# Altium schematic sheet MCU.SchDoc
size A4; SheetNumber: 10; SheetTotal: 10
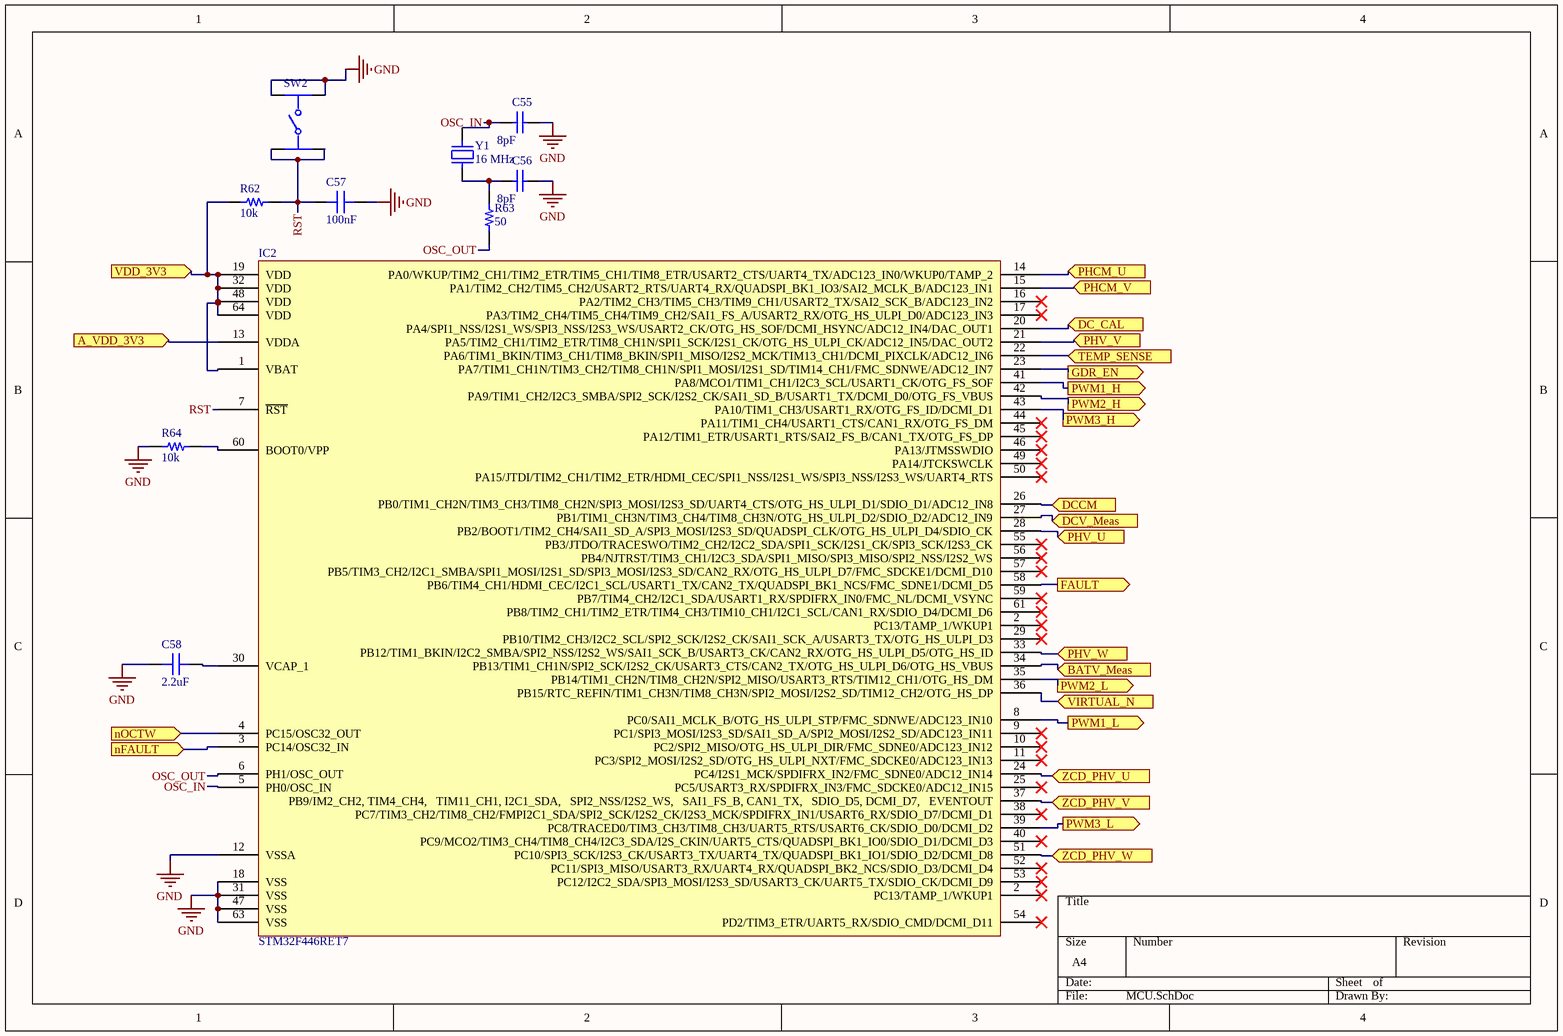
[diagram p0: MCU.SchDoc]

## Parts
C55  value 8pF  [CAPC1005X56X25LL10T15]  (hidden comment: 0402YA240JAT2A)
C56  value 8pF  [CAPC1005X56X25LL10T15]  (hidden comment: 0402YA240JAT2A)
C57  100nF  [CAP 0603_1608]
C58  2.2uF  [CAP 0603_1608]
IC2  STM32F446RET7  [ST LQFP-64 10X10MM]
R62  10k  [RES 0402_1005]
R63  50  [RES 0402_1005]
R64  10k  [RES 0402_1005]
SW2  3-1825910-1  [FP-3-1825910-1-MFG]  (value not drawn)
Y1  16 MHz  [NDK NX5032GA]

## Ports
A_VDD_3V3 (in, see DC-DC_Buck_Converter+12Vto+3.3V[4B]), BATV_Meas (in, see ADC_Input_protection[3C], DC_Current_Voltage_Measurement[2B]), DC_CAL (in, see MotorDrivers[1A]), DCCM (in, see ADC_Input_protection[3B], DC_Current_Voltage_Measurement[3A]), DCV_Meas (in, see ADC_Input_protection[2C], DC_Current_Voltage_Measurement[2B]), FAULT (out, see Power[2D]), GDR_EN (out, see MotorDrivers[1B], Power[2D]), nFAULT (in, see MotorDrivers[1A]), nOCTW (in, see MotorDrivers[2A]), PHCM_U (in, see ADC_Input_protection[2B], MotorDrivers[1C]), PHCM_V (in, see ADC_Input_protection[3B], MotorDrivers[1C]), PHV_U (in, see ADC_Input_protection[2B], PhaseVoltage[1A], ZeroCrossing[2B]), PHV_V (in, see ADC_Input_protection[3B], PhaseVoltage[1A], ZeroCrossing[2B]), PHV_W (in, see ADC_Input_protection[3B], PhaseVoltage[2A], ZeroCrossing[2C]), PWM1_H (out, see MotorDrivers[1B]), PWM1_L (out, see MotorDrivers[1B]), PWM2_H (out, see MotorDrivers[1B]), PWM2_L (out, see MotorDrivers[1B]), PWM3_H (out, see MotorDrivers[1B]), PWM3_L (out, see MotorDrivers[1B]), TEMP_SENSE (in, see DC_Current_Voltage_Measurement[3B]), VDD_3V3 (in, see ADC_Input_protection[3C], DC-DC_Buck_Converter+12Vto+3.3V[3C], DC_Current_Voltage_Measurement[3B], MotorDrivers[1A], MotorDrivers[1B], Power[2C], ZeroCrossing[1A]), VIRTUAL_N (in, see ADC_Input_protection[4B], PhaseVoltage[1A], ZeroCrossing[1B]), ZCD_PHV_U (in, see ZeroCrossing[3B]), ZCD_PHV_V (in, see ZeroCrossing[3B]), ZCD_PHV_W (in, see ZeroCrossing[3C])

## Nets
GND: C55.2 C56.2 C57.1 C58.2 IC2.12(VSSA) IC2.18(VSS) IC2.31(VSS) IC2.47(VSS) IC2.63(VSS) R64.1 SW2.3 SW2.4
A_VDD_3V3: IC2.13(VDDA) ; port A_VDD_3V3
BATV_Meas: IC2.34(PB13/TIM1_CH1N/SPI2_SCK/I2S2_CK/USART3_CTS/CAN2_TX/OTG_HS_ULPI_D6/OTG_HS_VBUS) ; port BATV_Meas
DC_CAL: IC2.20(PA4/SPI1_NSS/I2S1_WS/SPI3_NSS/I2S3_WS/USART2_CK/OTG_HS_SOF/DCMI_HSYNC/ADC12_IN4/DAC_OUT1) ; port DC_CAL
DCCM: IC2.26(PB0/TIM1_CH2N/TIM3_CH3/TIM8_CH2N/SPI3_MOSI/I2S3_SD/UART4_CTS/OTG_HS_ULPI_D1/SDIO_D1/ADC12_IN8) ; port DCCM
DCV_Meas: IC2.27(PB1/TIM1_CH3N/TIM3_CH4/TIM8_CH3N/OTG_HS_ULPI_D2/SDIO_D2/ADC12_IN9) ; port DCV_Meas
FAULT: IC2.58(PB6/TIM4_CH1/HDMI_CEC/I2C1_SCL/USART1_TX/CAN2_TX/QUADSPI_BK1_NCS/FMC_SDNE1/DCMI_D5) ; port FAULT
GDR_EN: IC2.23(PA7/TIM1_CH1N/TIM3_CH2/TIM8_CH1N/SPI1_MOSI/I2S1_SD/TIM14_CH1/FMC_SDNWE/ADC12_IN7) ; port GDR_EN
nFAULT: IC2.3(PC14/OSC32_IN) ; port nFAULT
nOCTW: IC2.4(PC15/OSC32_OUT) ; port nOCTW
OSC_IN: C55.1 IC2.5(PH0/OSC_IN) Y1.2
OSC_OUT: IC2.6(PH1/OSC_OUT) R63.1
PHCM_U: IC2.14(PA0/WKUP/TIM2_CH1/TIM2_ETR/TIM5_CH1/TIM8_ETR/USART2_CTS/UART4_TX/ADC123_IN0/WKUP0/TAMP_2) ; port PHCM_U
PHCM_V: IC2.15(PA1/TIM2_CH2/TIM5_CH2/USART2_RTS/UART4_RX/QUADSPI_BK1_IO3/SAI2_MCLK_B/ADC123_IN1) ; port PHCM_V
PHV_U: IC2.28(PB2/BOOT1/TIM2_CH4/SAI1_SD_A/SPI3_MOSI/I2S3_SD/QUADSPI_CLK/OTG_HS_ULPI_D4/SDIO_CK) ; port PHV_U
PHV_V: IC2.21(PA5/TIM2_CH1/TIM2_ETR/TIM8_CH1N/SPI1_SCK/I2S1_CK/OTG_HS_ULPI_CK/ADC12_IN5/DAC_OUT2) ; port PHV_V
PHV_W: IC2.33(PB12/TIM1_BKIN/I2C2_SMBA/SPI2_NSS/I2S2_WS/SAI1_SCK_B/USART3_CK/CAN2_RX/OTG_HS_ULPI_D5/OTG_HS_ID) ; port PHV_W
PWM1_H: IC2.41(PA8/MCO1/TIM1_CH1/I2C3_SCL/USART1_CK/OTG_FS_SOF) ; port PWM1_H
PWM1_L: IC2.8(PC0/SAI1_MCLK_B/OTG_HS_ULPI_STP/FMC_SDNWE/ADC123_IN10) ; port PWM1_L
PWM2_H: IC2.42(PA9/TIM1_CH2/I2C3_SMBA/SPI2_SCK/I2S2_CK/SAI1_SD_B/USART1_TX/DCMI_D0/OTG_FS_VBUS) ; port PWM2_H
PWM2_L: IC2.35(PB14/TIM1_CH2N/TIM8_CH2N/SPI2_MISO/USART3_RTS/TIM12_CH1/OTG_HS_DM) ; port PWM2_L
PWM3_H: IC2.43(PA10/TIM1_CH3/USART1_RX/OTG_FS_ID/DCMI_D1) ; port PWM3_H
PWM3_L: IC2.39(PC8/TRACED0/TIM3_CH3/TIM8_CH3/UART5_RTS/USART6_CK/SDIO_D0/DCMI_D2) ; port PWM3_L
RST: C57.2 IC2.7(~{RST}) R62.1 SW2.1 SW2.2
TEMP_SENSE: IC2.22(PA6/TIM1_BKIN/TIM3_CH1/TIM8_BKIN/SPI1_MISO/I2S2_MCK/TIM13_CH1/DCMI_PIXCLK/ADC12_IN6) ; port TEMP_SENSE
VDD_3V3: IC2.1(VBAT) IC2.19(VDD) IC2.32(VDD) IC2.48(VDD) IC2.64(VDD) R62.2 ; port VDD_3V3
VIRTUAL_N: IC2.36(PB15/RTC_REFIN/TIM1_CH3N/TIM8_CH3N/SPI2_MOSI/I2S2_SD/TIM12_CH2/OTG_HS_DP) ; port VIRTUAL_N
ZCD_PHV_U: IC2.24(PC4/I2S1_MCK/SPDIFRX_IN2/FMC_SDNE0/ADC12_IN14) ; port ZCD_PHV_U
ZCD_PHV_V: IC2.37(PB9/IM2_CH2,_TIM4_CH4,___TIM11_CH1,_I2C1_SDA,___SPI2_NSS/I2S2_WS,___SAI1_FS_B,_CAN1_TX,___SDIO_D5,_DCMI_D7,___EVENTOUT) ; port ZCD_PHV_V
ZCD_PHV_W: IC2.51(PC10/SPI3_SCK/I2S3_CK/USART3_TX/UART4_TX/QUADSPI_BK1_IO1/SDIO_D2/DCMI_D8) ; port ZCD_PHV_W
NetC56_1: C56.1 R63.2 Y1.1
NetC58_1: C58.1 IC2.30(VCAP_1)
NetIC2_60: IC2.60(BOOT0/VPP) R64.2

Not connected (* = marked no-connect by the designer): IC2 2(PC13/TAMP_1/WKUP1)* 9(PC1/SPI3_MOSI/I2S3_SD/SAI1_SD_A/SPI2_MOSI/I2S2_SD/ADC123_IN11)* 10(PC2/SPI2_MISO/OTG_HS_ULPI_DIR/FMC_SDNE0/ADC123_IN12)* 11(PC3/SPI2_MOSI/I2S2_SD/OTG_HS_ULPI_NXT/FMC_SDCKE0/ADC123_IN13)* 16(PA2/TIM2_CH3/TIM5_CH3/TIM9_CH1/USART2_TX/SAI2_SCK_B/ADC123_IN2)* 17(PA3/TIM2_CH4/TIM5_CH4/TIM9_CH2/SAI1_FS_A/USART2_RX/OTG_HS_ULPI_D0/ADC123_IN3)* 25(PC5/USART3_RX/SPDIFRX_IN3/FMC_SDCKE0/ADC12_IN15)* 29(PB10/TIM2_CH3/I2C2_SCL/SPI2_SCK/I2S2_CK/SAI1_SCK_A/USART3_TX/OTG_HS_ULPI_D3)* 38(PC7/TIM3_CH2/TIM8_CH2/FMPI2C1_SDA/SPI2_SCK/I2S2_CK/I2S3_MCK/SPDIFRX_IN1/USART6_RX/SDIO_D7/DCMI_D1)* 40(PC9/MCO2/TIM3_CH4/TIM8_CH4/I2C3_SDA/I2S_CKIN/UART5_CTS/QUADSPI_BK1_IO0/SDIO_D1/DCMI_D3)* 44(PA11/TIM1_CH4/USART1_CTS/CAN1_RX/OTG_FS_DM)* 45(PA12/TIM1_ETR/USART1_RTS/SAI2_FS_B/CAN1_TX/OTG_FS_DP)* 46(PA13/JTMSSWDIO)* 49(PA14/JTCKSWCLK)* 50(PA15/JTDI/TIM2_CH1/TIM2_ETR/HDMI_CEC/SPI1_NSS/I2S1_WS/SPI3_NSS/I2S3_WS/UART4_RTS)* 52(PC11/SPI3_MISO/USART3_RX/UART4_RX/QUADSPI_BK2_NCS/SDIO_D3/DCMI_D4)* 53(PC12/I2C2_SDA/SPI3_MOSI/I2S3_SD/USART3_CK/UART5_TX/SDIO_CK/DCMI_D9)* 54(PD2/TIM3_ETR/UART5_RX/SDIO_CMD/DCMI_D11)* 55(PB3/JTDO/TRACESWO/TIM2_CH2/I2C2_SDA/SPI1_SCK/I2S1_CK/SPI3_SCK/I2S3_CK)* 56(PB4/NJTRST/TIM3_CH1/I2C3_SDA/SPI1_MISO/SPI3_MISO/SPI2_NSS/I2S2_WS)* 57(PB5/TIM3_CH2/I2C1_SMBA/SPI1_MOSI/I2S1_SD/SPI3_MOSI/I2S3_SD/CAN2_RX/OTG_HS_ULPI_D7/FMC_SDCKE1/DCMI_D10)* 59(PB7/TIM4_CH2/I2C1_SDA/USART1_RX/SPDIFRX_IN0/FMC_NL/DCMI_VSYNC)* 61(PB8/TIM2_CH1/TIM2_ETR/TIM4_CH3/TIM10_CH1/I2C1_SCL/CAN1_RX/SDIO_D4/DCMI_D6)*

## Library data of the parts
C55 C56 = CMP-2008-02771-1: Manufacturer: AVX Interconnect / Elco; Part Number: 0402YA240JAT2A
C57 C58 = 0603ZC102KAT2A: CAP CER 1000PF 10V X7R 0603; manufacturer: AVX Corporation; Tolerance: ±10%; Part Number: 0603ZC102KAT2A; Applications: General Purpose; componentlink1description: Datasheet; componentlink1url: http://datasheets.avx.com/X7RDielectric.pdf; componentlink2description: DigiKey Link; componentlink2url: http://digikey.com/product-detail/en/avx-corporation/0603ZC102KAT2A/478-0603ZC102KAT2ACT-ND/11570315; Device Package: 0603 (1608 Metric); lastupdated: 2.09.2020 01:02:55; Lifecycle Status: Active; Minimum Order: 1; Mounting Type: Surface Mount, MLCC; Operating Temperature: -55°C ~ 125°C; Package / Case: 0603 (1608 Metric); packaging: TapeAndReel; partid: 27370; Part Status: Active; price: 0.01; series: -; Supplier 1: DigiKey; Supplier Part Number 1: 478-0603ZC102KAT2ACT-ND; Temperature Coefficient: X7R; Voltage - Rated: 10V
  C57: Value: 100nF; Capacitance: 100nF
  C58: Value: 2.2uF; Capacitance: 2.2uF
IC2 = STM32F446RET7: IC MCU 32BIT 512KB FLASH 64LQFP; Manufacturer: STMicroelectronics; Connectivity: CANbus, EBI/EMI, I²C, IrDA, LINbus, SAI, SD, SPDIF-Rx, SPI, UART/USART, USB, USB OTG; Core Processor: ARM® Cortex®-M4; Core Size: 32-Bit Single-Core; Data Converters: A/D 16x12b; D/A 2x12b; Number of I/O: 50; Oscillator Type: Internal; Peripherals: Brown-out Detect/Reset, DMA, I²S, LVD, POR, PWM, WDT; Program Memory Size: 512KB (512K x 8); RAM Size: 128K x 8; Speed: 180MHz; Voltage - Supply (Vcc/Vdd): 1.7V ~ 3.6V; Part Number: STM32F446RET7; ComponentLink1Description: Datasheet; ComponentLink1URL: https://www.st.com/content/ccc/resource/technical/document/datasheet/65/cb/75/50/53/d6/48/24/DM00141306.pdf/files/DM00141306.pdf/jcr:content/translations/en.DM00141306.pdf; ComponentLink2Description: DigiKey Link; ComponentLink2URL: https://www.digikey.com/en/products/detail/stmicroelectronics/STM32F446RET7/6207480; LastUpdated: 5.10.2023 20:25:32; Lifecycle Status: Active; Minimum Order: 1; Mounting Type: Surface Mount; Operating Temperature: -40°C ~ 105°C (TA); Packaging: Tray; PartId: 220; Part Status: Active; Price: 6.42; Program Memory Type: FLASH; Series: STM32F4; Supplier 1: DigiKey; Supplier Part Number 1: 497-16775-ND; Supplier Device Package: 64-LQFP (10x10)
R62 R64 = ESR01MZPF47R0: ANTI-SURGE CHIP RESISTORS; Manufacturer: Rohm Semiconductor; Power (Watts): 0.2W, 1/5W; Resistance: 10k Ohms; Temperature Coefficient: ±100ppm/°C; Tolerance: ±1%; Part Number: ESR01MZPF47R0; Value: 10k; ComponentLink1Description: Datasheet; ComponentLink1URL: https://fscdn.rohm.com/en/products/databook/datasheet/passive/resistor/chip_resistor/esr-e.pdf; ComponentLink2Description: DigiKey Link; ComponentLink2URL: https://www.digikey.com/en/products/detail/rohm-semiconductor/ESR01MZPF47R0/16180187; Composition: Thick Film; Device Package: 0402 (1005 Metric); Features: Automotive AEC-Q200, Pulse Withstanding; Height - Seated (Max): 0.016" (0.40mm); LastUpdated: 5.10.2023 19:23:22; Lifecycle Status: Active; Minimum Order: 1; Number of Terminations: 2; Operating Temperature: -55°C ~ 155°C; Package / Case: 0402 (1005 Metric); Packaging: TapeAndReel; PartId: 67421; Part Status: Active; Price: 0.03; Ratings: AEC-Q200; Series: ESR; Size / Dimension: 0.039" L x 0.020" W (1.00mm x 0.50mm); Supplier 1: DigiKey; Supplier Part Number 1: 511-ESR01MZPF47R0CT-ND; Supplier Device Package: 0402
R63 = UBR0402B500FZTR\500: 0402, 50 OHM; Manufacturer: AVX Corporation; Power (Watts): 0.125W, 1/8W; Resistance: 50 Ohms; Temperature Coefficient: ±100ppm/°C; Tolerance: ±1%; Part Number: UBR0402B500FZTR\500; Value: 50; ComponentLink1Description: Datasheet; ComponentLink1URL: http://datasheets.avx.com/AVX-UBR-Series.pdf; ComponentLink2Description: DigiKey Link; ComponentLink2URL: http://digikey.com/product-detail/en/avx-corporation/UBR0402B500FZTR-500/478-12030-1-ND/8595063; Composition: Thin Film; Device Package: 0402 (1005 Metric); Height - Seated (Max): 0.024" (0.60mm); LastUpdated: 2.09.2020 01:07:37; Lifecycle Status: Active; Minimum Order: 1; Number of Terminations: 2; Operating Temperature: -40°C ~ 125°C; Package / Case: 0402 (1005 Metric); Packaging: TapeAndReel; PartId: 17454; Part Status: Active; Price: 1.52; Series: UBR; Size / Dimension: 0.039" L x 0.020" W (1.00mm x 0.50mm); Supplier 1: DigiKey; Supplier Part Number 1: 478-12030-1-ND; Supplier Device Package: 0402
SW2 = CMP-03407-000001-1: SWITCH TACTILE SPST-NO 0.05A 24V; Manufacturer: TE Connectivity; Operating Force: 160gf; Contact Current Rating: 50mA; Contact Resistance: 100mΩ; Electromechanical Life: 100000Cycles; Device Class L1: Electromechanical; ComponentLink2URL: https://www.te.com/commerce/DocumentDelivery/DDEController?Action=srchrtrv&DocNm=1825910&DocType=Customer+Drawing&DocLang=English; Category: Switch; Device Class L2: Switches; Temperature: -35°C to +85°C; RoHS: TRUE; Mount: Through Hole; Manufacturer Part Number: 3-1825910-1; Automotive: No; Lead Free: Yes; Device Class L3: Tactile Switches; ComponentLink2Description: Datasheet; Temperature Range High: +85°C; Height: 17.3mm; Package: 0; Temperature Range Low: -35°C; Throw Configuration: SPST-NO; Digikey Description: SWITCH TACTILE SPST-NO 0.05A 24V; Octopart: https://octopart.com/3-1825910-1-te+connectivity-46506874
Y1 = NX5032GA-16MHZ-STD-CSK-4: CRYSTAL 16.0000MHZ 8PF SMD; Manufacturer: NDK America, Inc.; ESR (Equivalent Series Resistance): 50 Ohms; Frequency Stability: ±30ppm; Frequency Tolerance: ±20ppm; Operating Mode: Fundamental; Part Number: NX5032GA-16MHZ-STD-CSK-4; ComponentLink1Description: Datasheet; ComponentLink1URL: http://www.ndk.com/images/products/catalog/c_NX5032GA_e.pdf; ComponentLink2Description: DigiKey Link; ComponentLink2URL: https://www.digikey.com/en/products/detail/ndk-america-inc/NX5032GA-16MHZ-STD-CSK-4/3125646; Frequency: 16 MHz; Height - Seated (Max): 0.059" (1.50mm); LastUpdated: 6.10.2023 20:27:39; Lifecycle Status: Active; Load Capacitance: 8pF; Minimum Order: 1; Mounting Type: Surface Mount; Operating Temperature: -10°C ~ 70°C; Package / Case: 2-SMD, No Lead; Packaging: TapeAndReel; PartId: 630; Part Status: Active; Price: 0.34; Series: NX5032GA; Size / Dimension: 0.197" L x 0.126" W (5.00mm x 3.20mm); Supplier 1: DigiKey; Supplier Part Number 1: 644-1187-1-ND; Type: MHz Crystal; Value: 16 MHz